# EAGLE schematic cv06_dobes (EAGLE 7.7.0)
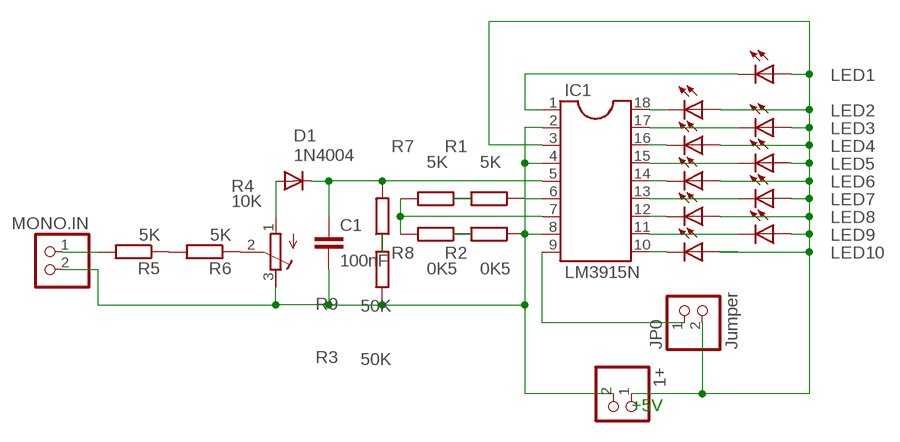
[diagram p0: schematic, sheet 1]

## Parts
1+  PINHD-1X2  [1X02]
C1  100nF  C-EU050-030X075  [C050-030X075]
D1  1N4004  [DO41-10]
IC1  LM3915N  DIL18S  [SOCKET-18]
JP0  Jumper  PINHD-1X2  [1X02]
LED1  LED5MM  [LED5MM]
LED2  LED5MM  [LED5MM]
LED3  LED5MM  [LED5MM]
LED4  LED5MM  [LED5MM]
LED5  LED5MM  [LED5MM]
LED6  LED5MM  [LED5MM]
LED7  LED5MM  [LED5MM]
LED8  LED5MM  [LED5MM]
LED9  LED5MM  [LED5MM]
LED10  LED5MM  [LED5MM]
MONO.IN  PINHD-1X2  [1X02]
R1  5K  R-EU_0207/7  [0207/7]
R2  0K5  R-EU_0207/7  [0207/7]
R3  50K  R-EU_0207/7  [0207/7]
R4  10K  R-TRIMM64P  [RTRIM64P]
R5  5K  R-EU_0207/7  [0207/7]
R6  5K  R-EU_0207/7  [0207/7]
R7  5K  R-EU_0207/7  [0207/7]
R8  0K5  R-EU_0207/7  [0207/7]
R9  50K  R-EU_0207/7  [0207/7]

## Nets
N$1: MONO.IN.1 R5.2
N$2: R4.2(S) R6.1
N$3: D1.A R4.1(E)
N$4: C1.1 D1.C IC1.5 R9.2
N$5: IC1.7 R7.2 R8.2
N$6: IC1.9 JP0.1
N$7: IC1.6 R1.1
N$8: R5.1 R6.2
N$9: 1+.2 C1.2 IC1.2 IC1.4 IC1.8 MONO.IN.2 R2.1 R3.1 R4.3(A)
N$10: 1+.1 IC1.3 JP0.2 LED1.A LED2.A LED3.A LED4.A LED5.A LED6.A LED7.A LED8.A LED9.A LED10.A
N$11: IC1.1 LED1.K(C)
N$12: IC1.18 LED2.K(C)
N$13: IC1.17 LED3.K(C)
N$14: IC1.16 LED4.K(C)
N$15: IC1.15 LED5.K(C)
N$16: IC1.14 LED6.K(C)
N$17: IC1.13 LED7.K(C)
N$18: IC1.12 LED8.K(C)
N$19: IC1.11 LED9.K(C)
N$20: IC1.10 LED10.K(C)
N$21: R2.2 R8.1
N$22: R1.2 R7.1
N$23: R3.2 R9.1

## Notes on the sheet
- +5V

## Library data of the parts
1+ JP0 MONO.IN = pinhead:PINHD-1X2: PIN HEADER
C1 = rcl:C-EU: CAPACITOR, European symbol
D1 = diode:1N4004: DIODE general purpose rectifier, 1 A
IC1 = ic-package:DIL18: Dual In Line / Socket
LED1-LED10 = led:LED: LED OSRAM: - CHIPLED LG R971, LG N971, LY N971, LG Q971, LY Q971, LO R971, LY R971 LH N974, LH R974 LS Q976, LO Q976, LY Q976 LO Q996 - Hyper CHIPLED LW Q18S LB Q993, LB Q99A, LB R99A - SideLED LS A670, LO A670, LY A670, LG A670, LP A670 LB A673, LV A673, LT A673, LW A673 LH A674 LY A675 LS A676, LA A676, LO A676, LY A676, LW A676 LS A679, LY A679, LG A679 - Hyper Micro SIDELED® LS Y876, LA Y876, LO Y876, LY Y876 LT Y87S - SmartLED LW L88C, LW L88S LB L89C, LB L89S, LG L890 LS L89K, LO L89K, LY L89K LS L896, LA L896, LO L896, LY L896 - TOPLED LS T670, LO T670, LY T670, LG T670, LP T670 LSG T670, LSP T670, LSY T670, LOP T670, LYG T670 LG T671, LOG T671, LSG T671 LB T673, LV T673, LT T673, LW T673 LH T674 LS T676, LA T676, LO T676, LY T676, LB T676, LH T676, LSB T676, LW T676 LB T67C, LV T67C, LT T67C, LS T67K, LO T67K, LY T67K, LW E67C LS E67B, LA E67B, LO E67B, LY E67B, LB E67C, LV E67C, LT E67C LW T67C LS T679, LY T679, LG T679 LS T770, LO T770, LY T770, LG T770, LP T770 LB T773, LV T773, LT T773, LW T773 LH T774 LS E675, LA E675, LY E675, LS T675 LS T776, LA T776, LO T776, LY T776, LB T776 LHGB T686 LT T68C, LB T68C - Hyper Mini TOPLED® LB M676 - Mini TOPLED Santana® LG M470 LS M47K, LO M47K, LY M47K Source: http://www.osram.convergy.de LUXEON: - LUMILED® LXK2-PW12-R00, LXK2-PW12-S00, LXK2-PW14-U00, LXK2-PW14-V00 LXK2-PM12-R00, LXK2-PM12-S00, LXK2-PM14-U00 LXK2-PE12-Q00, LXK2-PE12-R00, LXK2-PE12-S00, LXK2-PE14-T00, LXK2-PE14-U00 LXK2-PB12-K00, LXK2-PB12-L00, LXK2-PB12-M00, LXK2-PB14-N00, LXK2-PB14-P00, LXK2-PB14-Q00 LXK2-PR12-L00, LXK2-PR12-M00, LXK2-PR14-Q00, LXK2-PR14-R00 LXK2-PD12-Q00, LXK2-PD12-R00, LXK2-PD12-S00 LXK2-PH12-R00, LXK2-PH12-S00 LXK2-PL12-P00, LXK2-PL12-Q00, LXK2-PL12-R00 Source: www.luxeon.com KINGBRIGHT: KA-3528ASYC Source: www.kingbright.com
R1-R3 R5-R9 = rcl:R-EU_: RESISTOR, European symbol
R4 = rcl:R-TRIMM: Trimm resistor